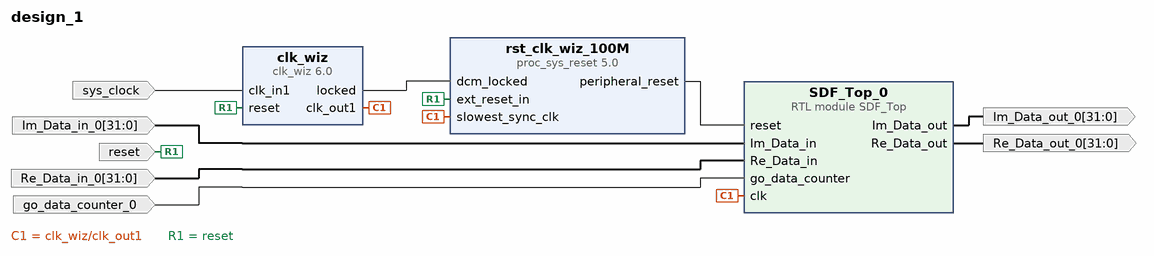
[diagram p0: block diagram of the top level]
# Vivado block design design_1, xc7a35tcpg236-1, Vivado 2022.1
create_bd_design design_1

create_bd_port -dir I -type clk sys_clock
set_property -dict {CONFIG.FREQ_HZ 100000000 CONFIG.PHASE 0.0} [get_bd_ports sys_clock]
create_bd_port -dir I -type rst reset
set_property -dict {CONFIG.POLARITY ACTIVE_HIGH} [get_bd_ports reset]
create_bd_port -dir I go_data_counter_0
create_bd_port -dir I -from 31 -to 0 Im_Data_in_0
create_bd_port -dir O -from 31 -to 0 Re_Data_out_0
create_bd_port -dir O -from 31 -to 0 Im_Data_out_0
create_bd_port -dir I -from 31 -to 0 Re_Data_in_0

create_bd_cell -type module -reference SDF_Top SDF_Top_0
set_property -dict {CONFIG.DATA_WIDTH 32 CONFIG.FFT_TOT_POINTS 4096} [get_bd_cells SDF_Top_0]
create_bd_cell -type ip -vlnv xilinx.com:ip:clk_wiz:6.0 clk_wiz
set_property -dict [list \
  CONFIG.CLK_IN1_BOARD_INTERFACE sys_clock \
  CONFIG.RESET_BOARD_INTERFACE reset \
  CONFIG.USE_BOARD_FLOW true \
] [get_bd_cells clk_wiz]
create_bd_cell -type ip -vlnv xilinx.com:ip:proc_sys_reset:5.0 rst_clk_wiz_100M
set_property -dict {CONFIG.RESET_BOARD_INTERFACE reset CONFIG.USE_BOARD_FLOW true} [get_bd_cells rst_clk_wiz_100M]

# ---- connections ----

connect_bd_net -net Im_Data_in_0_1 [get_bd_ports Im_Data_in_0] [get_bd_pins SDF_Top_0/Im_Data_in]
connect_bd_net -net Re_Data_in_0_1 [get_bd_ports Re_Data_in_0] [get_bd_pins SDF_Top_0/Re_Data_in]
connect_bd_net [get_bd_pins SDF_Top_0/Im_Data_out] [get_bd_ports Im_Data_out_0]
connect_bd_net [get_bd_pins SDF_Top_0/Re_Data_out] [get_bd_ports Re_Data_out_0]
connect_bd_net [get_bd_pins clk_wiz/clk_out1] [get_bd_pins SDF_Top_0/clk] [get_bd_pins rst_clk_wiz_100M/slowest_sync_clk]
connect_bd_net [get_bd_pins clk_wiz/locked] [get_bd_pins rst_clk_wiz_100M/dcm_locked]
connect_bd_net -net go_data_counter_0_1 [get_bd_ports go_data_counter_0] [get_bd_pins SDF_Top_0/go_data_counter]
connect_bd_net [get_bd_ports reset] [get_bd_pins clk_wiz/reset] [get_bd_pins rst_clk_wiz_100M/ext_reset_in]
connect_bd_net [get_bd_pins rst_clk_wiz_100M/peripheral_reset] [get_bd_pins SDF_Top_0/reset]
connect_bd_net [get_bd_ports sys_clock] [get_bd_pins clk_wiz/clk_in1]

validate_bd_design
save_bd_design
